# Altium schematic sheet TruckCape J1708 and Relays v4 - MITM.SchDoc: Beaglebone Black Truck Cape - MITM
size Letter; Author: Dr. Jeremy Daily; Organization: Mechanical Engineering; Address1: The University of Tulsa; Address2: 800 S Tucker Dr; Address3: Tulsa, OK 74104; DocumentNumber: J1708 and Switching Relays; Revision: 3; SheetNumber: 2; SheetTotal: 2
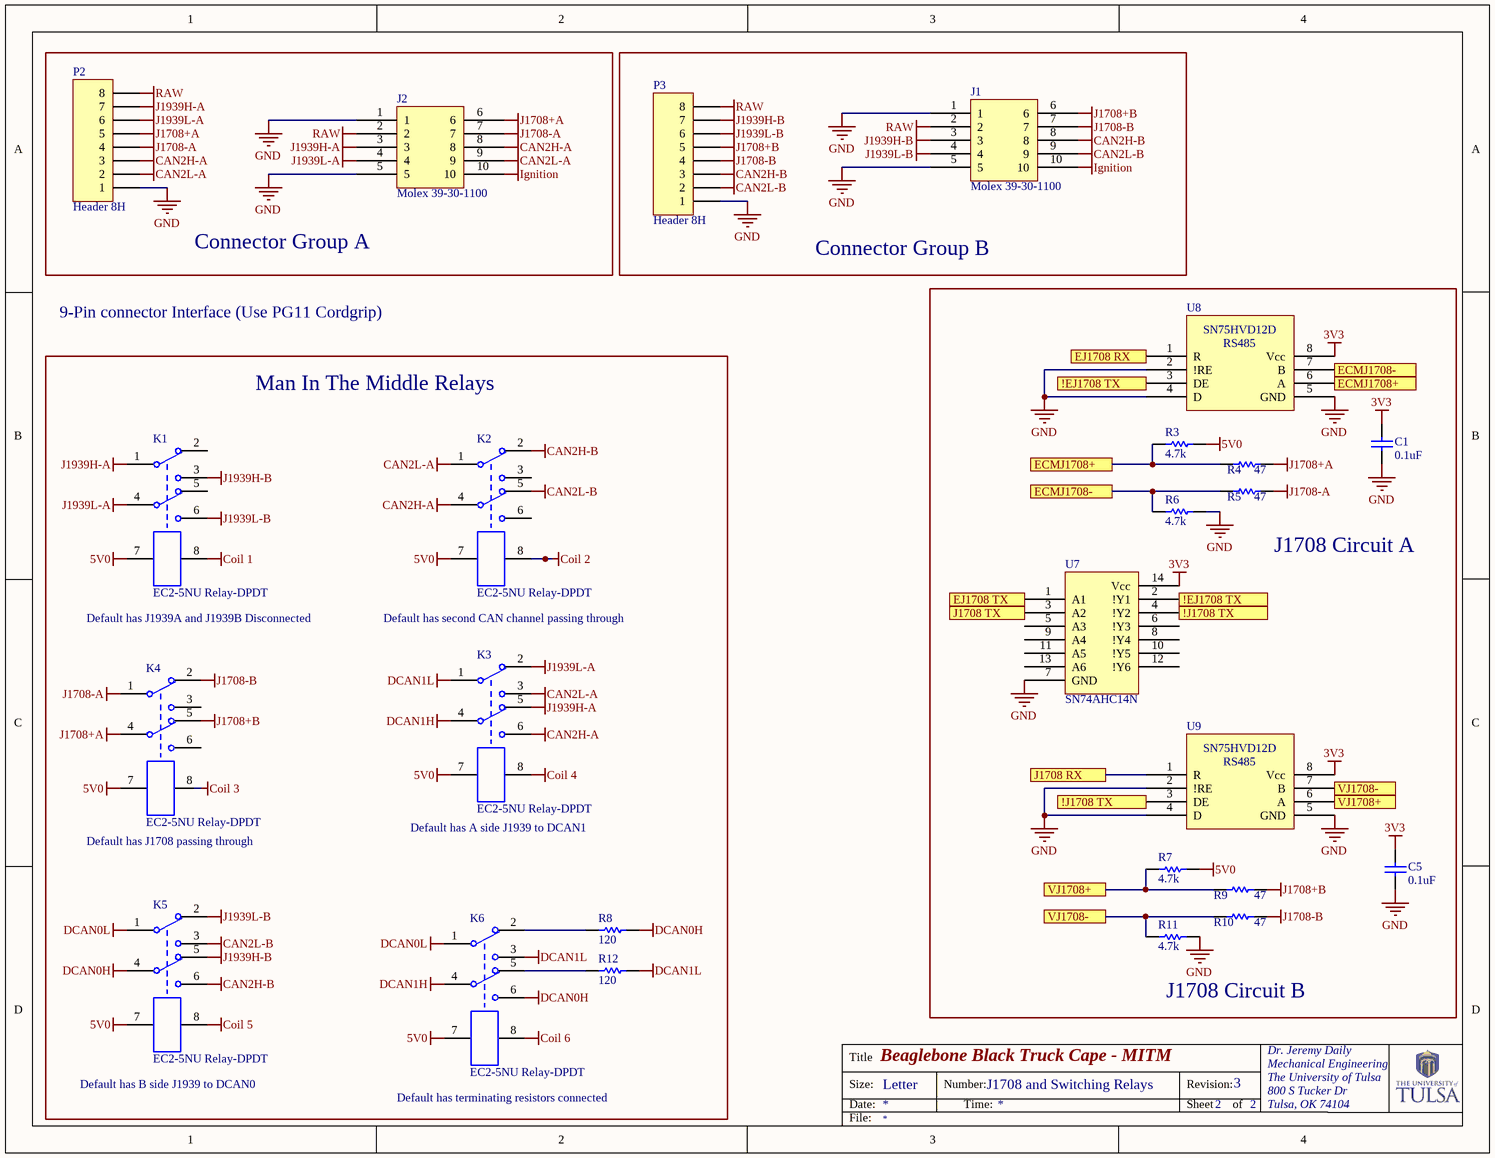
[diagram p0: TruckCape J1708 and Relays v4 - MITM.SchDoc]

## Parts
C1  0.1uF  [CAPR5-4X5]
C5  0.1uF  [CAPR5-4X5]
J1  Molex 39-30-1100  [10 pos Mini-Fit Jr. R/A Header]
J2  Molex 39-30-1100  [10 pos Mini-Fit Jr. R/A Header]
K1  EC2-5NU Relay-DPDT  [RELAY - EC2]
K2  EC2-5NU Relay-DPDT  [RELAY - EC2]
K3  EC2-5NU Relay-DPDT  [RELAY - EC2]
K4  EC2-5NU Relay-DPDT  [RELAY - EC2]
K5  EC2-5NU Relay-DPDT  [RELAY - EC2]
K6  EC2-5NU Relay-DPDT  [RELAY - EC2]
P2  Header 8H  [8 CKT Spring Header]
P3  Header 8H  [8 CKT Spring Header]
R3  4.7k  [Axial-0.4]
R4  47  [Axial-0.4]
R5  47  [Axial-0.4]
R6  4.7k  [Axial-0.4]
R7  4.7k  [Axial-0.4]
R8  120  [Axial-0.4]
R9  47  [Axial-0.4]
R10  47  [Axial-0.4]
R11  4.7k  [Axial-0.4]
R12  120  [Axial-0.4]
U7  SN74AHC14N  [DIP14]
U8  SN75HVD12  [DIP8]  (value not drawn)
U9  SN75HVD12  [DIP8]  (value not drawn)

## Blocks framed on the sheet
Connector Group A: J2 P2
Connector Group B: J1 P3
Man In The Middle Relays: K1-K6 R8 R12

## Ports
!EJ1708 TX, !J1708 TX, ECMJ1708+, ECMJ1708-, EJ1708 RX, EJ1708 TX, J1708 RX, J1708 TX, VJ1708+, VJ1708-

## Nets
3V3: C1.2 C5.2 U7.14(Vcc) U8.8(Vcc) U9.8(Vcc)
5V0: K1.7 K2.7 K3.7 K4.7 K5.7 K6.7 R3.2 R7.2
CAN2H-A: J2.8 K2.4 K3.6 P2.3
CAN2H-B: J1.8 K2.2 K5.6 P3.3
CAN2L-A: J2.9 K2.1 K3.3 P2.2
CAN2L-B: J1.9 K2.5 K5.3 P3.2
Coil 1: K1.8
Coil 2: K2.8
Coil 3: K4.8
Coil 4: K3.8
Coil 5: K5.8
Coil 6: K6.8
DCAN0H: K5.4 K6.6 R8.1
DCAN0L: K5.1 K6.1
DCAN1H: K3.4 K6.4
DCAN1L: K3.1 K6.3 R12.1
GND: C1.1 C5.1 J1.1 J1.5 J2.1 J2.5 P2.1 P3.1 R6.2 R11.2 U7.7(GND) U8.2(!RE) U8.4(D) U8.5(GND) U9.2(!RE) U9.4(D) U9.5(GND)
Ignition: J1.10 J2.10
J1708+A: J2.6 K4.4 P2.5 R4.2
J1708+B: J1.6 K4.5 P3.5 R9.2
J1708-A: J2.7 K4.1 P2.4 R5.2
J1708-B: J1.7 K4.2 P3.4 R10.2
J1939H-A: J2.3 K1.1 K3.5 P2.7
J1939H-B: J1.3 K1.3 K5.5 P3.7
J1939L-A: J2.4 K1.4 K3.2 P2.6
J1939L-B: J1.4 K1.6 K5.2 P3.6
RAW: J1.2 J2.2 P2.8 P3.8
!EJ1708 TX: U7.2(!Y1) U8.3(DE) ; port !EJ1708 TX
!J1708 TX: U7.4(!Y2) U9.3(DE) ; port !J1708 TX
ECMJ1708+: R3.1 R4.1 U8.6(A) ; port ECMJ1708+
ECMJ1708-: R5.1 R6.1 U8.7(B) ; port ECMJ1708-
EJ1708 RX: U8.1(R) ; port EJ1708 RX
EJ1708 TX: U7.1(A1) ; port EJ1708 TX
J1708 RX: U9.1(R) ; port J1708 RX
J1708 TX: U7.3(A2) ; port J1708 TX
VJ1708+: R7.1 R9.1 U9.6(A) ; port VJ1708+
VJ1708-: R10.1 R11.1 U9.7(B) ; port VJ1708-
NetK6_2: K6.2 R8.2
NetK6_5: K6.5 R12.2

Not connected (* = marked no-connect by the designer): K1 2 5; K2 3 6; K4 3 6; U7 5(A3) 6(!Y3) 8(!Y4) 9(A4) 10(!Y5) 11(A5) 12(!Y6) 13(A6)

## Notes on the sheet
- 9-Pin connector Interface (Use PG11 Cordgrip)
- J1708 Circuit A
- Default has J1939A and J1939B Disconnected
- Default has second CAN channel passing through
- (near K3) Default has A side J1939 to DCAN1
- Default has J1708 passing through
- J1708 Circuit B
- Default has B side J1939 to DCAN0
- Default has terminating resistors connected
- Title
- Size:
- Date:
- Letter
- Number:
- Time:
- Revision:
- Sheet
- of
- File:
- (in symbol SN75HVD12D (3.3v RS485)) SN75HVD12D; RS485

## Library data of the parts
C1 C5 = Cap: CAP CER 0.1UF 100V X7R RADIAL; Manufacturer: Vishay BC Components; PartNumber: K104K20X7RH53H5; Supplier 1: Digi-Key; Supplier Part Number 1: BC5139-ND
J1 J2 = 10 Pos Header: 10 Positions Header Connector 0.165" (4.20mm) Through Hole, Right Angle Tin; Manufacturer: Molex; Supplier 1: Digi-Key; PartNumber: 39-30-1100; Supplier Part Number 1: WM1355-ND
K1-K6 = Relay-DPDT: General Purpose Relay DPDT (2 Form C) Through Hole; Manufacturer: KEMET; Published: 24-Mar-1999; LatestRevisionDate: 17-Jul-2002; LatestRevisionNote: Re-released for DXP Platform.; PackageReference: DIP-P8; Publisher: Altium Limited; PackageDescription: Relay; 8 Leads; PartNumber: EC2-5NU; Supplier 1: Digi-Key; Supplier Part Number 1: 399-11052-5-ND
P2 P3 = Header 8H: 8 Position Wire to Board Terminal Block Vertical with Board 0.100" (2.54mm) Through Hole; Manufacturer: Phoenix Contact; PartNumber: 1789472; LatestRevisionDate: 17-Jul-2002; LatestRevisionNote: Re-released for DXP Platform.; Publisher: Altium Limited; Supplier 1: Digi-Key; Supplier Part Number 1: 277-14044-ND
R3 R6 R7 R11 = Chip Resistor: RES SMD 4.7K OHM 1% 1/10W 0603; Manufacturer: Yageo; PartNumber: CFR-25JB-52-4K7; Supplier 1: Digi-Key; Supplier Part Number 1: 4.7KQBK-ND
R4 R5 R9 R10 = Chip Resistor: 47 Ohms ±5% 0.25W, 1/4W Through Hole Resistor Axial  Carbon Film; Manufacturer: Yageo; PartNumber: CFR-25JB-52-47R; Supplier 1: Digi-Key; Supplier Part Number 1: 47QBK-ND
R8 R12 = Chip Resistor: 120 Ohms ±0.1% 0.25W, 1/4W Through Hole Resistor Axial  Metal Film; Manufacturer: Yageo; PartNumber: MFP-25BRD52-120R; Supplier 1: Digi-Key; Supplier Part Number 1: 120ADCT-ND
U7 = 74VHC14 Hex Inverter: Inverter IC 6 Channel Schmitt Trigger 14-PDIP; Manufacturer: Texas Instruments; Supplier 1: Digi-Key; Supplier Part Number 1: 296-4550-5-ND; PartNumber: SN74AHC14N
U8 U9 = SN75HVD12D (3.3v RS485): IC 3.3V DIFF TXRX 8-SOIC; Manufacturer: Texas Instruments; PartNumber: SN75HVD12P; Supplier 1: Digi-Key; Supplier Part Number 1: SN75HVD12P